# Altium schematic sheet BalEv_FPTG_Bank0_v1_0.SchDoc
size A4; CompanyName: HESSO; Address1: Route du Rawyl 47; Address2: 1950 Sion; Address3: Switzerland; DocumentNumber: 5; SheetNumber: 4; SheetTotal: 6; PageSetup: Record=PageOptions|CenterHorizontal=True|CenterVertical=True|PrintScale=1.00|XCorrection=1.00|YCorrection=1.00|PrintKind=1|BorderSize=5000000|LeftOffset=0|BottomOffset=0|Orientation=2|PaperLength=1000|PaperWidth=1000|Scale=100|PaperSource=15|PrintQuality=1200|MediaType=1|DitherType=10|PrintScaleMode=1|PaperKind=A4|PaperIndex=9; ProjectName: Project Name
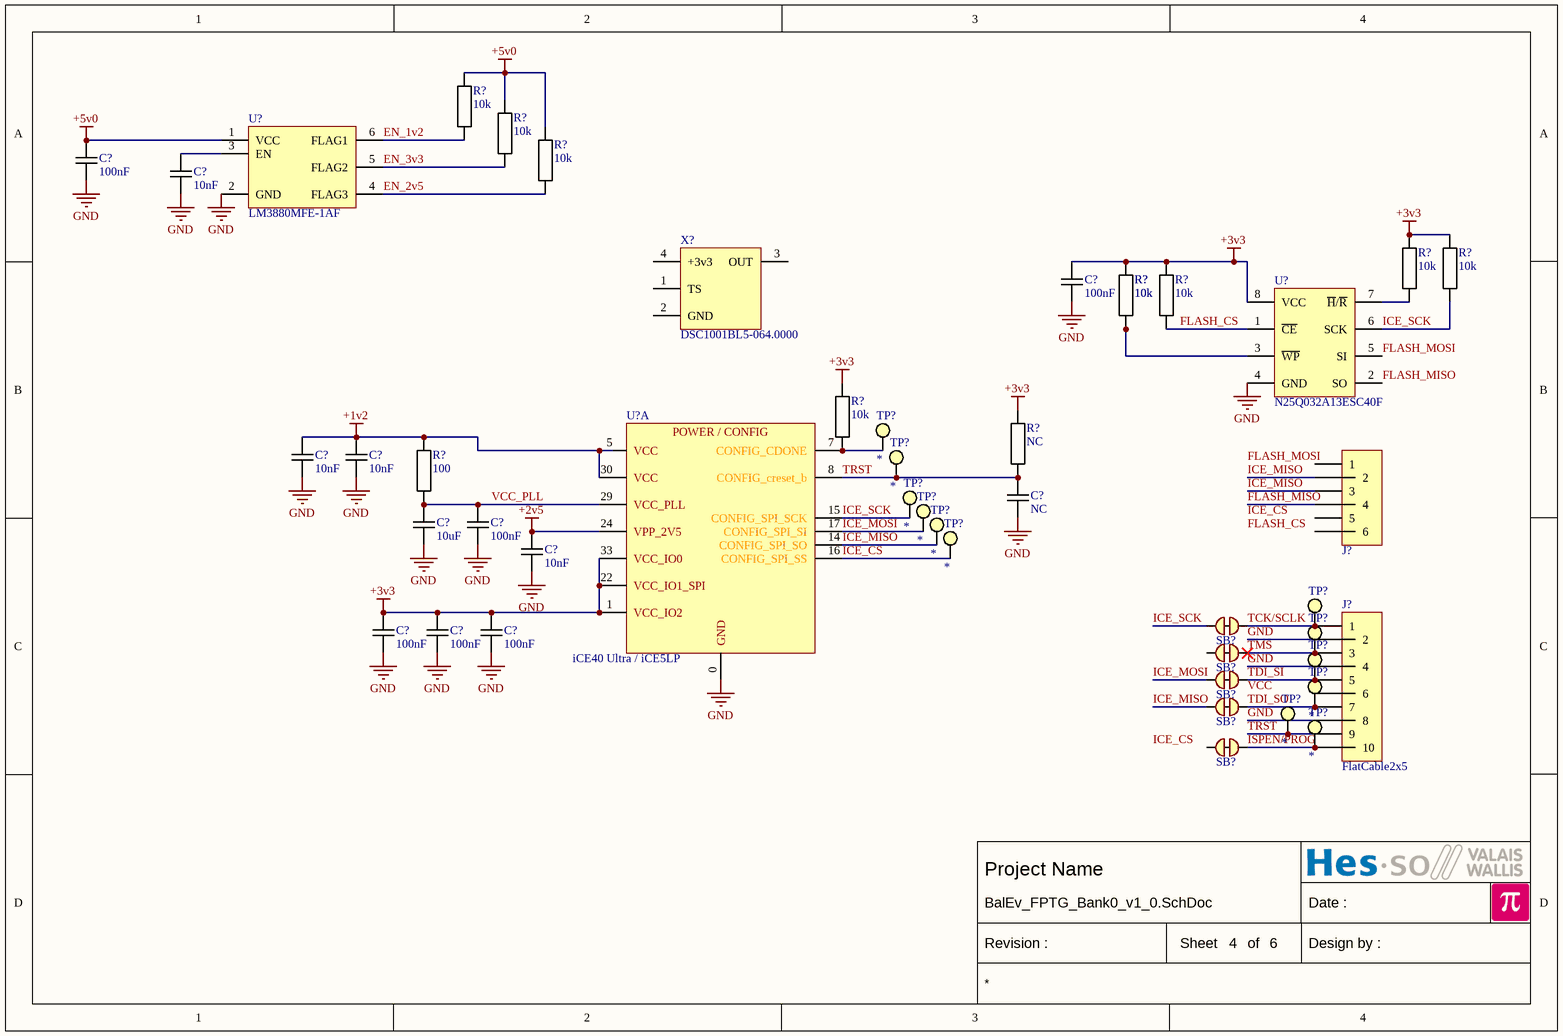
[diagram p0: BalEv_FPTG_Bank0_v1_0.SchDoc]

## Parts
(Parts that share a designator on the sheet are numbered #1, #2 ... from top to bottom, then left to right.)
C?#1  100nF  [CAPACITOR 1005 REFLOW]
C?#2  10nF  [CAPACITOR 1005 REFLOW]
C?#3  100nF  [CAPACITOR 1005 REFLOW]
C?#4  10nF  [CAPACITOR 1005 REFLOW]
C?#5  10nF  [CAPACITOR 1005 REFLOW]
C?#6  NC  [CAPACITOR 1005 REFLOW]
C?#7  10uF  [CAPACITOR 1608 REFLOW]
C?#8  100nF  [CAPACITOR 1005 REFLOW]
C?#9  10nF  [CAPACITOR 1005 REFLOW]
C?#10  100nF  [CAPACITOR 1005 REFLOW]
C?#11  100nF  [CAPACITOR 1005 REFLOW]
C?#12  100nF  [CAPACITOR 1005 REFLOW]
J?#1  *  [PinHeader2x3 P2.54]  (value not drawn)
J?#2  FlatCable2x5  [FlatCable2x5 2MM Straight TH FCI 98414-G06-10ULF]
R?#1  10k  [RESISTOR 1005 REFLOW]
R?#2  10k  [RESISTOR 1005 REFLOW]
R?#3  10k  [RESISTOR 1005 REFLOW]
R?#4  10k  [RESISTOR 1005 REFLOW]
R?#5  10k  [RESISTOR 1005 REFLOW]
R?#6  10k  [RESISTOR 1005 REFLOW]
R?#7  10k  [RESISTOR 1005 REFLOW]
R?#8  10k  [RESISTOR 1005 REFLOW]
R?#9  10k  [RESISTOR 1005 REFLOW]
R?#10  NC  [RESISTOR 1005 REFLOW]
R?#11  100  [RESISTOR 1005 REFLOW]
SB?#1  *  [Solder Bridge 1mm Connected]  (value not drawn)  (net tie, no BOM)
SB?#2  *  [Solder Bridge 1mm Connected]  (value not drawn)  (net tie, no BOM)
SB?#3  *  [Solder Bridge 1mm Connected]  (value not drawn)  (net tie, no BOM)
SB?#4  *  [Solder Bridge 1mm Connected]  (value not drawn)  (net tie, no BOM)
SB?#5  *  [Solder Bridge 1mm Connected]  (value not drawn)  (net tie, no BOM)
TP?#1  *  [Hole 0.25 D0.8]  (no BOM)
TP?#2  *  [Hole 0.25 D0.8]  (no BOM)
TP?#3  *  [Hole 0.25 D0.8]  (no BOM)
TP?#4  *  [Hole 0.25 D0.8]  (no BOM)
TP?#5  *  [Hole 0.25 D0.8]  (no BOM)
TP?#6  *  [Hole 0.25 D0.8]  (no BOM)
TP?#7  *  [Hole 0.25 D0.8]  (no BOM)
TP?#8  *  [Hole 0.25 D0.8]  (no BOM)
TP?#9  *  [Hole 0.25 D0.8]  (no BOM)
TP?#10  *  [Hole 0.25 D0.8]  (no BOM)
TP?#11  *  [Hole 0.25 D0.8]  (no BOM)
TP?#12  *  [Hole 0.25 D0.8]  (no BOM)
U?#1  LM3880MFE-1AF  [SC70-6 P0.65 C1.4x2.2 H1.0]
U?#2  N25Q032A13ESC40F  [SO8 P1.27 C4.0X5.0 H1.75]
U?#3  iCE40 Ultra / iCE5LP  [QFN50P700X700X100_HS-49N]  (part A of 4)
X?  DSC1001BL5-064.0000  [Oscillator C5.0x3.2 Abracon ASFL1]

## Nets
+1v2: C?#4.2 C?#5.2 R?#11.2 U?#3.5(VCC) U?#3.30(VCC)
+2v5: C?#9.2 U?#3.24(VPP_2V5)
+3v3: C?#3.2 C?#10.2 C?#11.2 C?#12.2 R?#4.2 R?#5.2 R?#6.2 R?#7.2 R?#8.2 R?#9.2 R?#10.2 U?#2.8(VCC) U?#3.1(VCC_IO2) U?#3.22(VCC_IO1_SPI) U?#3.33(VCC_IO0)
+5v0: C?#1.2 R?#1.2 R?#2.2 R?#3.2 U?#1.1(VCC)
GND: C?#1.1 C?#2.1 C?#3.1 C?#4.1 C?#5.1 C?#6.1 C?#7.1 C?#8.1 C?#9.1 C?#10.1 C?#11.1 C?#12.1 J?#2.2 J?#2.4 J?#2.8 U?#1.2(GND) U?#2.4(GND) U?#3.0(GND)
EN_1v2: R?#1.1 U?#1.6(FLAG1)
EN_2v5: R?#3.1 U?#1.4(FLAG3)
EN_3v3: R?#2.1 U?#1.5(FLAG2)
FLASH_CS: R?#8.1 U?#2.1(~{CE})
FLASH_MISO: J?#1.4 U?#2.2(SO)
FLASH_MOSI: U?#2.5(SI)
ICE_CS: TP?#6.1 U?#3.16(CONFIG_SPI_SS)
ICE_MISO: J?#1.2 J?#1.3 SB?#4.2 TP?#5.1 U?#3.14(CONFIG_SPI_SO)
ICE_MOSI: SB?#3.2 TP?#4.1 U?#3.17(CONFIG_SPI_SI)
ICE_SCK: R?#5.1 SB?#1.2 TP?#3.1 U?#2.6(SCK) U?#3.15(CONFIG_SPI_SCK)
ISPEN/PROG: J?#2.10 SB?#5.1 TP?#12.1
TCK/SCLK: J?#2.1 SB?#1.1 TP?#7.1
TDI_SI: J?#2.5 SB?#3.1 TP?#9.1
TDI_SO: J?#2.7 SB?#4.1 TP?#10.1
TMS: J?#2.3 SB?#2.1 TP?#8.1
TRST: C?#6.2 J?#2.9 R?#10.1 TP?#2.1 TP?#11.1 U?#3.8(CONFIG_creset_b)
VCC_PLL: C?#7.2 C?#8.2 R?#11.1 U?#3.29(VCC_PLL)
NetC?#2_2: C?#2.2 U?#1.3(EN)
NetR?#4_1: R?#4.1 U?#2.7(~{H}/~{R})
NetR?#6_1: R?#6.1 R?#7.1 U?#2.3(~{WP})
NetR?#9_1: R?#9.1 TP?#1.1 U?#3.7(CONFIG_CDONE)

Not connected (* = marked no-connect by the designer): J?#1 1 5 6; J?#2 6; SB?#2 2(1); SB?#5 2(1); X? 1(TS) 2(GND) 3(OUT) 4(+3v3)

## Notes on the sheet
- Labels drawn without touching a wire or pin: FLASH_CS, FLASH_MOSI, ICE_CS, VCC
- Date :
- Revision :
- Sheet
- of
- Design by :
- (in symbol ICE5LP1K-SG48, part A) POWER / CONFIG

## Library data of the parts
C?#1-C?#12 = Capacitor
  C?#1 C?#3 C?#8 C?#10-C?#12: Value: 100nF
  C?#2 C?#4 C?#5 C?#9: Value: 10nF
  C?#6: Value: NC
  C?#7: Value: 10uF
J?#1 = PinHeader2x3: Plug connector; Value: *
R?#1-R?#11 = Resistor
  R?#1-R?#9: Value: 10k
  R?#10: Value: NC
  R?#11: Value: 100
SB?#1-SB?#5 = Solderbridge Connected: Value: *
TP?#1-TP?#12 = Hole: Value: *
U?#1 = LM3880MF-1__: Three-Rail Simple Power Supply Sequencer; Value: LM3880MFE-1AF
U?#2 = IS25LP064D-JB: 32Mb Serial Flash Memory; Value: N25Q032A13ESC40F
U?#3 = ICE5LP1K-SG48
X? = Oscillator C5.0x3.2 Abracon ASFL1: Value: DSC1001BL5-064.0000